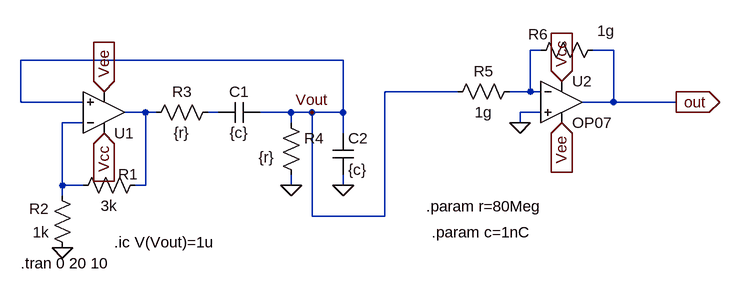
[diagram p0: schematic wein_bridge1.asc]
wein_bridge1.asc, the LTspice schematic file:
Version 4.1
SHEET 1 964 680
WIRE 384 16 368 16
WIRE 496 16 464 16
WIRE 80 32 -416 32
WIRE 256 80 144 80
WIRE 368 80 368 16
WIRE 368 80 336 80
WIRE 384 80 368 80
WIRE -416 96 -416 32
WIRE -320 96 -416 96
WIRE 496 96 496 16
WIRE 496 96 448 96
WIRE 592 96 496 96
WIRE -224 112 -256 112
WIRE -208 112 -224 112
WIRE -112 112 -128 112
WIRE 0 112 -48 112
WIRE 32 112 0 112
WIRE 80 112 80 32
WIRE 80 112 32 112
WIRE 384 112 352 112
WIRE -320 128 -352 128
WIRE 0 128 0 112
WIRE 352 128 352 112
WIRE 80 144 80 112
WIRE -352 224 -352 128
WIRE -320 224 -352 224
WIRE -224 224 -224 112
WIRE -224 224 -240 224
WIRE 0 224 0 208
WIRE 80 224 80 208
WIRE -352 240 -352 224
WIRE 32 272 32 112
WIRE 144 272 144 80
WIRE 144 272 32 272
FLAG -352 320 0
FLAG 32 112 Vout
FLAG 0 224 0
FLAG 80 224 0
FLAG -288 144 Vcc
IOPIN -288 144 In
FLAG -288 80 Vee
IOPIN -288 80 In
FLAG 352 128 0
FLAG 416 64 Vcc
IOPIN 416 64 In
FLAG 416 128 Vee
IOPIN 416 128 In
FLAG 592 96 out
IOPIN 592 96 Out
SYMBOL Opamps\\UniversalOpamp2 -288 112 M180
SYMATTR InstName U1
SYMBOL res -224 208 R90
WINDOW 0 15 27 VBottom 2
WINDOW 3 32 56 VTop 2
SYMATTR InstName R1
SYMATTR Value 3k
SYMBOL res -336 336 R180
WINDOW 0 36 76 Left 2
WINDOW 3 36 40 Left 2
SYMATTR InstName R2
SYMATTR Value 1k
SYMBOL res -112 96 R90
WINDOW 0 0 56 VBottom 2
WINDOW 3 32 56 VTop 2
SYMATTR InstName R3
SYMATTR Value {r}
SYMBOL cap -48 96 R90
WINDOW 0 0 32 VBottom 2
WINDOW 3 32 32 VTop 2
SYMATTR InstName C1
SYMATTR Value {c}
SYMBOL res -16 112 R0
WINDOW 3 -34 69 Left 2
SYMATTR Value {r}
SYMATTR InstName R4
SYMBOL cap 64 144 R0
SYMATTR InstName C2
SYMATTR Value {c}
SYMBOL OpAmps\\OP07 416 32 R0
SYMATTR InstName U2
SYMBOL res 352 64 R90
WINDOW 0 0 56 VBottom 2
WINDOW 3 32 56 VTop 2
SYMATTR InstName R5
SYMATTR Value 1g
SYMBOL res 480 0 R90
WINDOW 0 7 100 VBottom 2
WINDOW 3 -29 -4 VTop 2
SYMATTR InstName R6
SYMATTR Value 1g
TEXT -272 312 Left 2 !.ic V(Vout)=1u
TEXT 208 256 Left 2 !.param r=80Meg
TEXT 216 296 Left 2 !.param c=1nC
TEXT -416 344 Left 2 !.tran 0 20 10

The netlist it stands for:
* wein_bridge1.asc
X§U1 Vout N004 Vcc Vee N002 level.2 Avol=1Meg GBW=10Meg Slew=10Meg ilimit=25m rail=0 Vos=0 phimargin=45 en=0 enk=0 in=0 ink=0 Rin=500Meg  ; pins IN+ IN- V+ V- OUT
R1 N002 N004 3k
R2 0 N004 1k
R3 N003 N002 {r}
C1 Vout N003 {c}
R4 Vout 0 {r}
C2 Vout 0 {c}
X§U2 0 N001 Vcc Vee out LT1001  ; OP07, pins In+ In- V+ V- OUT
R5 N001 Vout 1g
R6 out N001 1g
.ic V(Vout)=1u
.param r=80Meg
.param c=1nC
.tran 0 20 10
.lib UniversalOpamps2.sub
.lib LTC.lib
.backanno
.end